# EAGLE design papr (EAGLE 9.6.1)
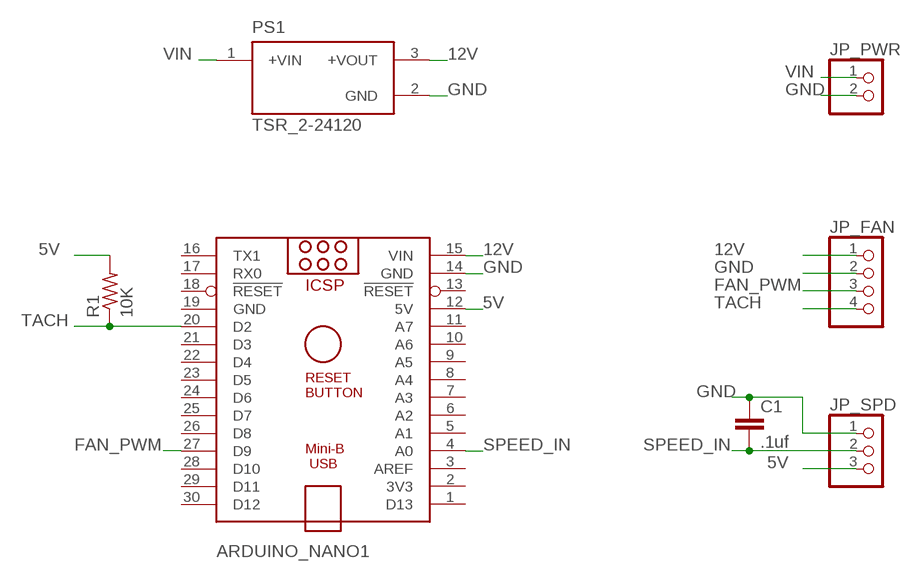
[diagram p0: schematic, sheet 1]

## Parts
ARDUINO_NANO1  ARDUINO_NANO  [ARDUINO_NANO]
C1  .1uf  C2,5-3  [C2.5-3]
JP_FAN  PINHD-1X4  [1X04]
JP_PWR  PINHD-1X2  [1X02]
JP_SPD  PINHD-1X3  [1X03]
PS1  TSR_2-24120  [CONV_TSR_2-24120]
R1  10K  R-US_0204/5  [0204/5]

## Nets
5V: ARDUINO_NANO1.12(5V) JP_SPD.3 R1.2
12V: ARDUINO_NANO1.15(VIN) JP_FAN.1 PS1.3(+VOUT)
FAN_PWM: ARDUINO_NANO1.27(D9) JP_FAN.3
GND: ARDUINO_NANO1.14(GND) C1.1 JP_FAN.2 JP_PWR.2 JP_SPD.1 PS1.2(GND)
SPEED_IN: ARDUINO_NANO1.4(A0) C1.2 JP_SPD.2
TACH: ARDUINO_NANO1.20(D2) JP_FAN.4 R1.1
VIN: JP_PWR.1 PS1.1(+VIN)
Unconnected: ARDUINO_NANO1.1(D13) ARDUINO_NANO1.2(3V3) ARDUINO_NANO1.3(AREF) ARDUINO_NANO1.5(A1) ARDUINO_NANO1.6(A2) ARDUINO_NANO1.7(A3) ARDUINO_NANO1.8(A4) ARDUINO_NANO1.9(A5) ARDUINO_NANO1.10(A6) ARDUINO_NANO1.11(A7) ARDUINO_NANO1.13(!RESET) ARDUINO_NANO1.16(TX1) ARDUINO_NANO1.17(RX0) ARDUINO_NANO1.18(!RESET) ARDUINO_NANO1.21(D3) ARDUINO_NANO1.22(D4) ARDUINO_NANO1.23(D5) ARDUINO_NANO1.24(D6) ARDUINO_NANO1.25(D7) ARDUINO_NANO1.26(D8) ARDUINO_NANO1.28(D10) ARDUINO_NANO1.29(D11) ARDUINO_NANO1.30(D12)

## Power pins joined to a net without a drawn wire
GND: ARDUINO_NANO1.19(GND)

## Library data of the parts
ARDUINO_NANO1 = ArduinoNanoV30:ARDUINO_NANO: Arduino Nano V3.0 Overview: The Arduino Nano is a small, complete, and breadboard-friendly board based on the ATmega328 (Arduino Nano 3.x) or ATmega168 (Arduino Nano 2.x). It has more or less the same functionality of the Arduino Duemilanove, but in a different package. It lacks only a DC power jack, and works with a Mini-B USB cable instead of a standard one. The Nano was designed and is being produced by Gravitech. Specifications: Microcontroller Atmel ATmega168 or ATmega328 Operating Voltage (logic level) 5 V Input Voltage (recommended) 7-12 V Input Voltage (limits) 6-20 V Digital I/O Pins 14 (of which 6 provide PWM output) Analog Input Pins 8 DC Current per I/O Pin 40 mA Flash Memory 16 KB (ATmega168) or 32 KB (ATmega328) of which 2 KB used by bootloader SRAM 1 KB (ATmega168) or 2 KB (ATmega328) EEPROM 512 bytes (ATmega168) or 1 KB (ATmega328) Clock Speed 16 MHz Dimensions 0.73" x 1.70" Length 45 mm Width 18 mm Weigth 5 g Power: The Arduino Nano can be powered via the Mini-B USB connection, 6-20V unregulated external power supply (pin 30), or 5V regulated external power supply (pin 27). The power source is automatically selected to the highest voltage source. Memory: The ATmega168 has 16 KB of flash memory for storing code (of which 2 KB is used for the bootloader); the ATmega328 has 32 KB, (also with 2 KB used for the bootloader). The ATmega168 has 1 KB of SRAM and 512 bytes of EEPROM (which can be read and written with the EEPROM library); the ATmega328 has 2 KB of SRAM and 1 KB of EEPROM. Input and Output: Each of the 14 digital pins on the Nano can be used as an input or output, using pinMode(), digitalWrite(), and digitalRead() functions. They operate at 5 volts. Each pin can provide or receive a maximum of 40 mA and has an internal pull-up resistor (disconnected by default) of 20-50 kOhms. In addition, some pins have specialized functions. Visit Arduino - ArduinoBoardNano <https://www.arduino.cc/en/Main/ArduinoBoardNano>
C1 = capacitor-wima:C: CAPACITOR naming: grid - package width
JP_FAN = pinhead:PINHD-1X4: PIN HEADER
JP_PWR = pinhead:PINHD-1X2: PIN HEADER
JP_SPD = pinhead:PINHD-1X3: PIN HEADER
PS1 = TSR_2-24120:TSR_2-24120: Linear Regulator Replacement DC DC Converter 1 Output 12V 2A 15V - 36V Input; AVAILABILITY: Unavailable; DESCRIPTION: Linear Regulator Replacement DC DC Converter 1 Output 12V 2A 15V - 36V Input; MF: Traco Power; MP: TSR 2-24120; PACKAGE: SIP-3 Traco Power; PRICE: None
R1 = rcl:R-US_: RESISTOR, American symbol; SPICEPREFIX: R

## Board
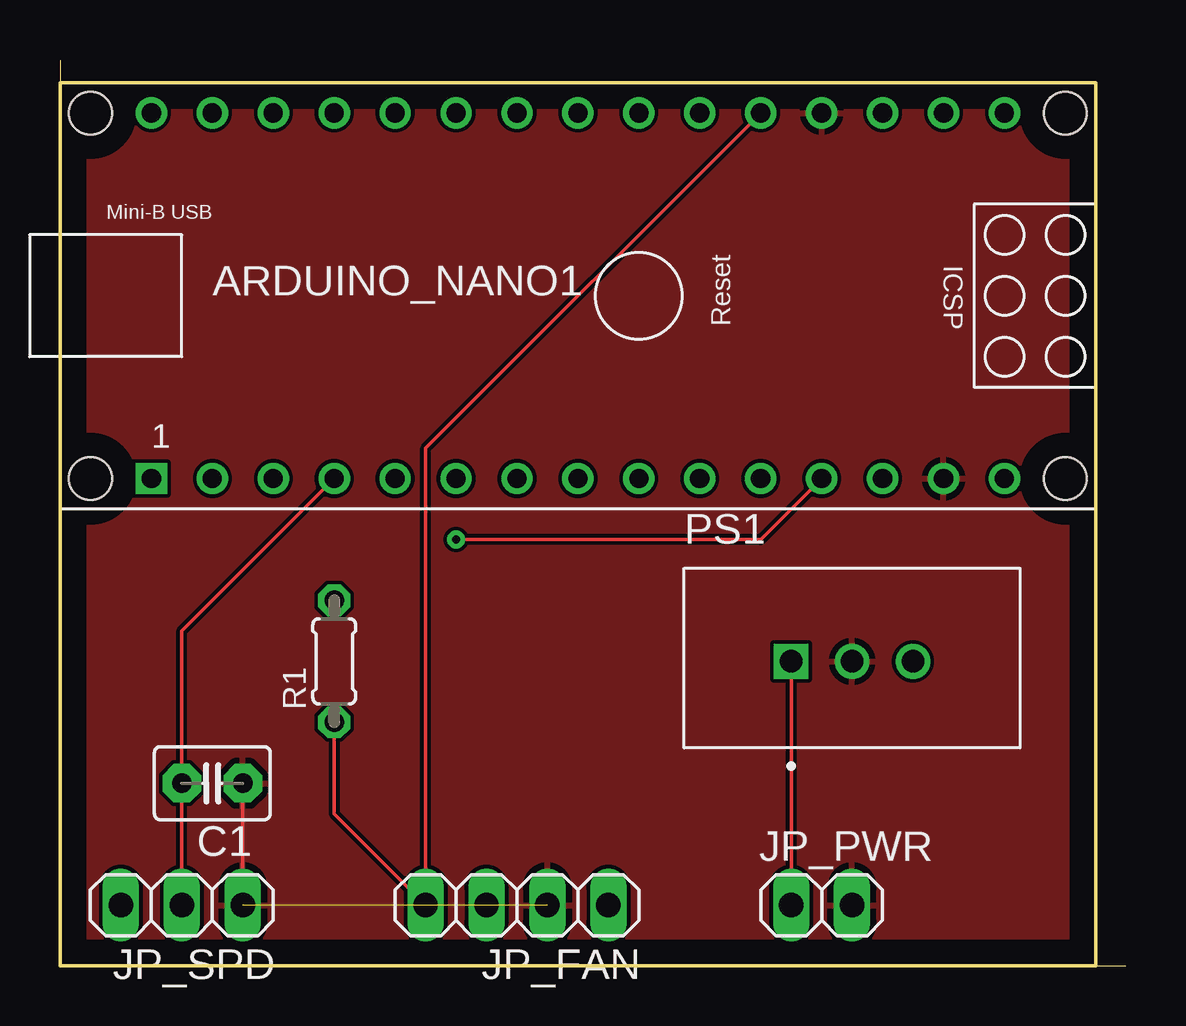
[diagram p1: board, top side]
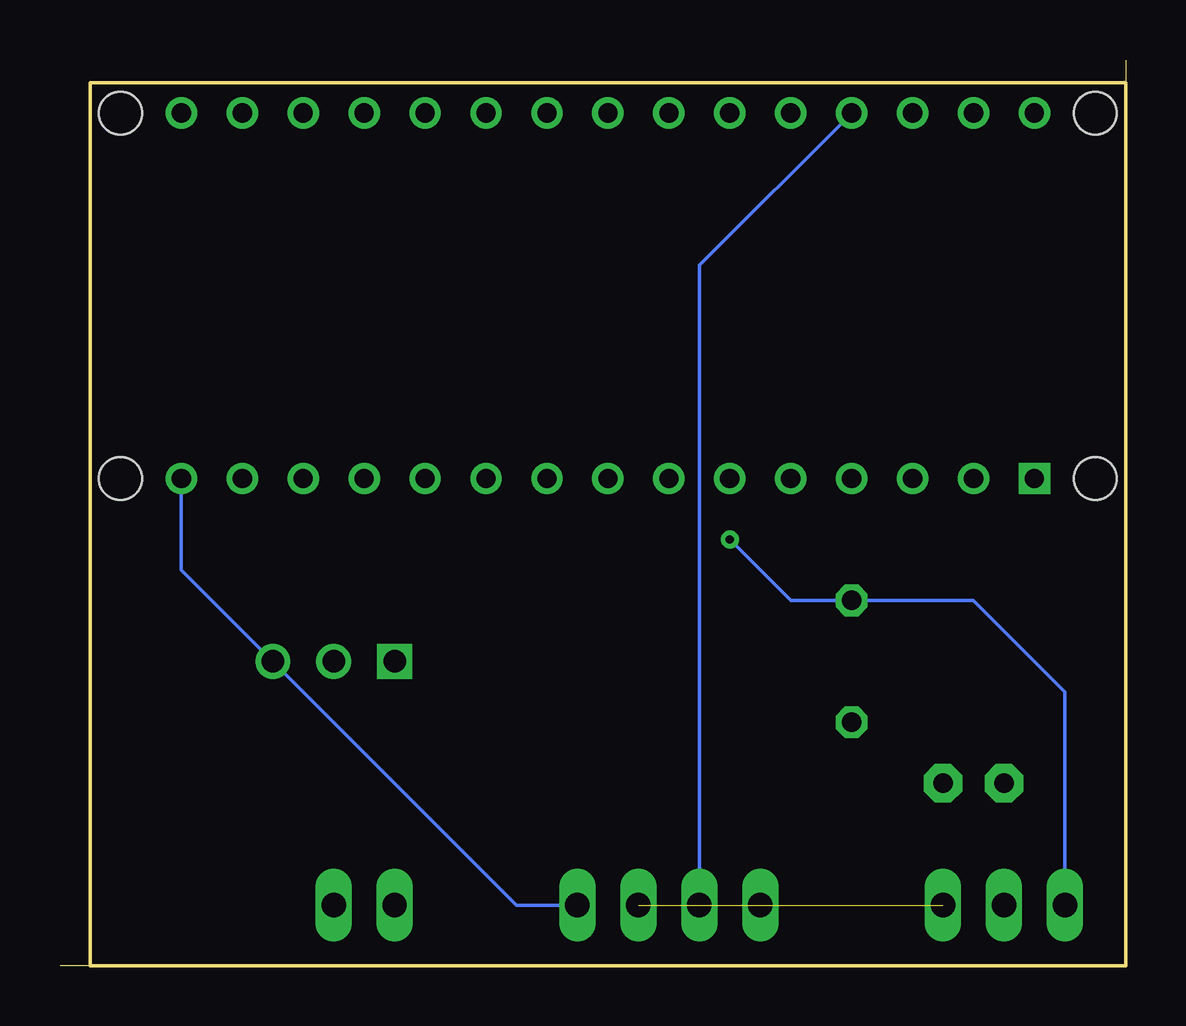
[diagram p2: board, bottom side, seen from below]

Size 44.43 x 37.77 mm. Coordinates in mm from the lower left corner, seen from the top.
Outline: 43.18,0 44.43,0
Outline: 0,37.77 0,36.83
Outline: 0,36.83 43.18,36.83 43.18,0
Outline: 43.18,0 0,0 0,36.83
Copper layers (1*16): Top 0.035mm / dielectric 1.5mm / Bottom 0.035mm
Design rules "default": minimum track width 6mil, minimum drill 0.35mm, track to track 6mil, track to pad 6mil, pad to pad 6mil, via to via 6mil, smd to smd 6mil, copper to edge 40mil, drill to drill 6mil, minimum pad ring 10mil, minimum via ring 8mil, stop-mask expansion 4mil, vias tented up to drill 0mil, thermal gap 10mil

### Footprints (pad centres in the part's own frame; a part is rotated, then mirrored left to right if it is on the bottom)
ARDUINO_NANO = drill 0.8 square: 1 -20.32,-7.62 | drill 0.8: 2 -17.78,-7.62; 3 -15.24,-7.62; 4 -12.7,-7.62; 5 -10.16,-7.62; 6 -7.62,-7.62; 7 -5.08,-7.62; 8 -2.54,-7.62; 9 0,-7.62; 10 2.54,-7.62; 11 5.08,-7.62; 12 7.62,-7.62; 13 10.16,-7.62; 14 12.7,-7.62; 15 15.24,-7.62; 16 15.24,7.62; 17 12.7,7.62; 18 10.16,7.62; 19 7.62,7.62; 20 5.08,7.62; 21 2.54,7.62; 22 0,7.62; 23 -2.54,7.62; 24 -5.08,7.62; 25 -7.62,7.62; 26 -10.16,7.62; 27 -12.7,7.62; 28 -15.24,7.62; 29 -17.78,7.62; 30 -20.32,7.62 | hole 1.778: -22.86,-7.62; -22.86,7.62; 17.78,7.62; 17.78,-7.62
C2.5-3 = drill 0.813 pad 1.6 octagon: 1 -1.27,0; 2 1.27,0
1X04 = drill 1.016 long: 1 -3.81,0; 2 -1.27,0; 3 1.27,0; 4 3.81,0
1X02 = drill 1.016 long: 1 -1.27,0; 2 1.27,0
1X03 = drill 1.016 long: 1 -2.54,0; 2 0,0; 3 2.54,0
CONV_TSR_2-24120 = drill 0.94 pad 1.41 square: 1 0,0 | drill 0.94 pad 1.41: 2 2.54,0; 3 5.08,0
0204/5 = drill 0.813 octagon: 1 -2.54,0; 2 2.54,0

### Placement (x,y rotation side)
ARDUINO_NANO1  24.13,27.94 0 top
C1  6.35,7.62 180 top
JP_FAN  19.05,2.54 180 top
JP_PWR  31.75,2.54 0 top
JP_SPD  5.08,2.54 180 top
PS1  30.48,12.7 0 top
R1  11.43,12.7 90 top

### Tracks (layer width: path | path; a pad name or v marks a point on that pad's centre or on a via)
5V  (via drill 0.35)
  Top 0.152: ARDUINO_NANO1.12 29.21,17.78 v16.51,17.78
  Bottom 0.152: v16.51,17.78 13.97,15.24 R1.2 6.35,15.24 2.54,11.43 JP_SPD.3
12V
  Bottom 0.152: ARDUINO_NANO1.15 39.37,16.51 PS1.3 25.4,2.54 JP_FAN.1
FAN_PWM
  Bottom 0.152: JP_FAN.3 17.78,29.21 ARDUINO_NANO1.27
GND  (1 unrouted)
  Top 0.152: JP_SPD.1 C1.1
  pour Top: 0,44.45 0,0 48.26,0 48.26,44.45
SPEED_IN
  Top 0.152: JP_SPD.2 C1.2 5.08,13.97 ARDUINO_NANO1.4
TACH
  Top 0.152: ARDUINO_NANO1.20 15.24,21.59 JP_FAN.4 11.43,6.35 R1.1
VIN
  Top 0.152: JP_PWR.1 PS1.1